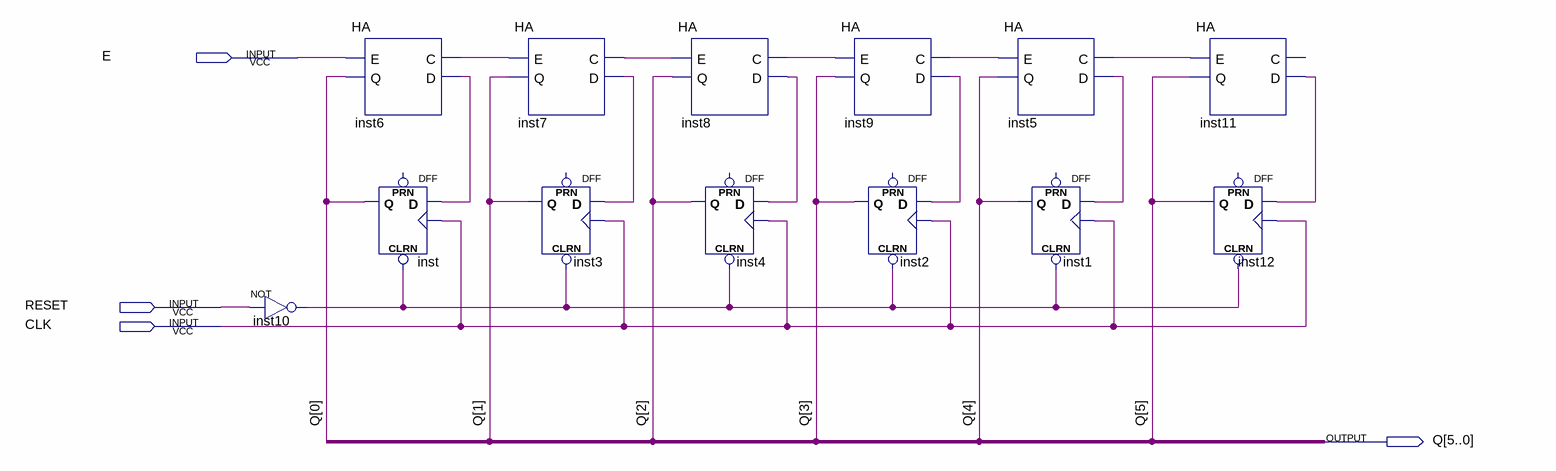
[diagram p0: schematic sheet]
// Quartus schematic counter.bdf as structural Verilog: 13 symbols, 4 pins
module counter (
  input  E,
  input  RESET,
  input  CLK,
  output [5:0] Q
);

  wire inst5_c, inst5_d, inst6_c, inst6_d, inst7_c, inst7_d, inst8_c, inst8_d, inst9_c, inst9_d, inst10_out,
       inst11_d;

  not inst10 (inst10_out, RESET);
  HA inst6 (.E(E), .Q(Q[0]), .C(inst6_c), .D(inst6_d));
  DFF inst (.CLRN(inst10_out), .CLK(CLK), .D(inst6_d), .Q(Q[0]));  // open: PRN
  HA inst7 (.E(inst6_c), .Q(Q[1]), .C(inst7_c), .D(inst7_d));
  DFF inst3 (.CLRN(inst10_out), .CLK(CLK), .D(inst7_d), .Q(Q[1]));  // open: PRN
  HA inst8 (.E(inst7_c), .Q(Q[2]), .C(inst8_c), .D(inst8_d));
  DFF inst4 (.CLRN(inst10_out), .CLK(CLK), .D(inst8_d), .Q(Q[2]));  // open: PRN
  HA inst9 (.E(inst8_c), .Q(Q[3]), .C(inst9_c), .D(inst9_d));
  DFF inst2 (.CLRN(inst10_out), .CLK(CLK), .D(inst9_d), .Q(Q[3]));  // open: PRN
  HA inst5 (.E(inst9_c), .Q(Q[4]), .C(inst5_c), .D(inst5_d));
  DFF inst1 (.CLRN(inst10_out), .CLK(CLK), .D(inst5_d), .Q(Q[4]));  // open: PRN
  HA inst11 (.E(inst5_c), .Q(Q[5]), .D(inst11_d));  // open: C
  DFF inst12 (.CLRN(inst10_out), .CLK(CLK), .D(inst11_d), .Q(Q[5]));  // open: PRN
endmodule
